# EAGLE design grblboard_base (EAGLE 7.5.0)
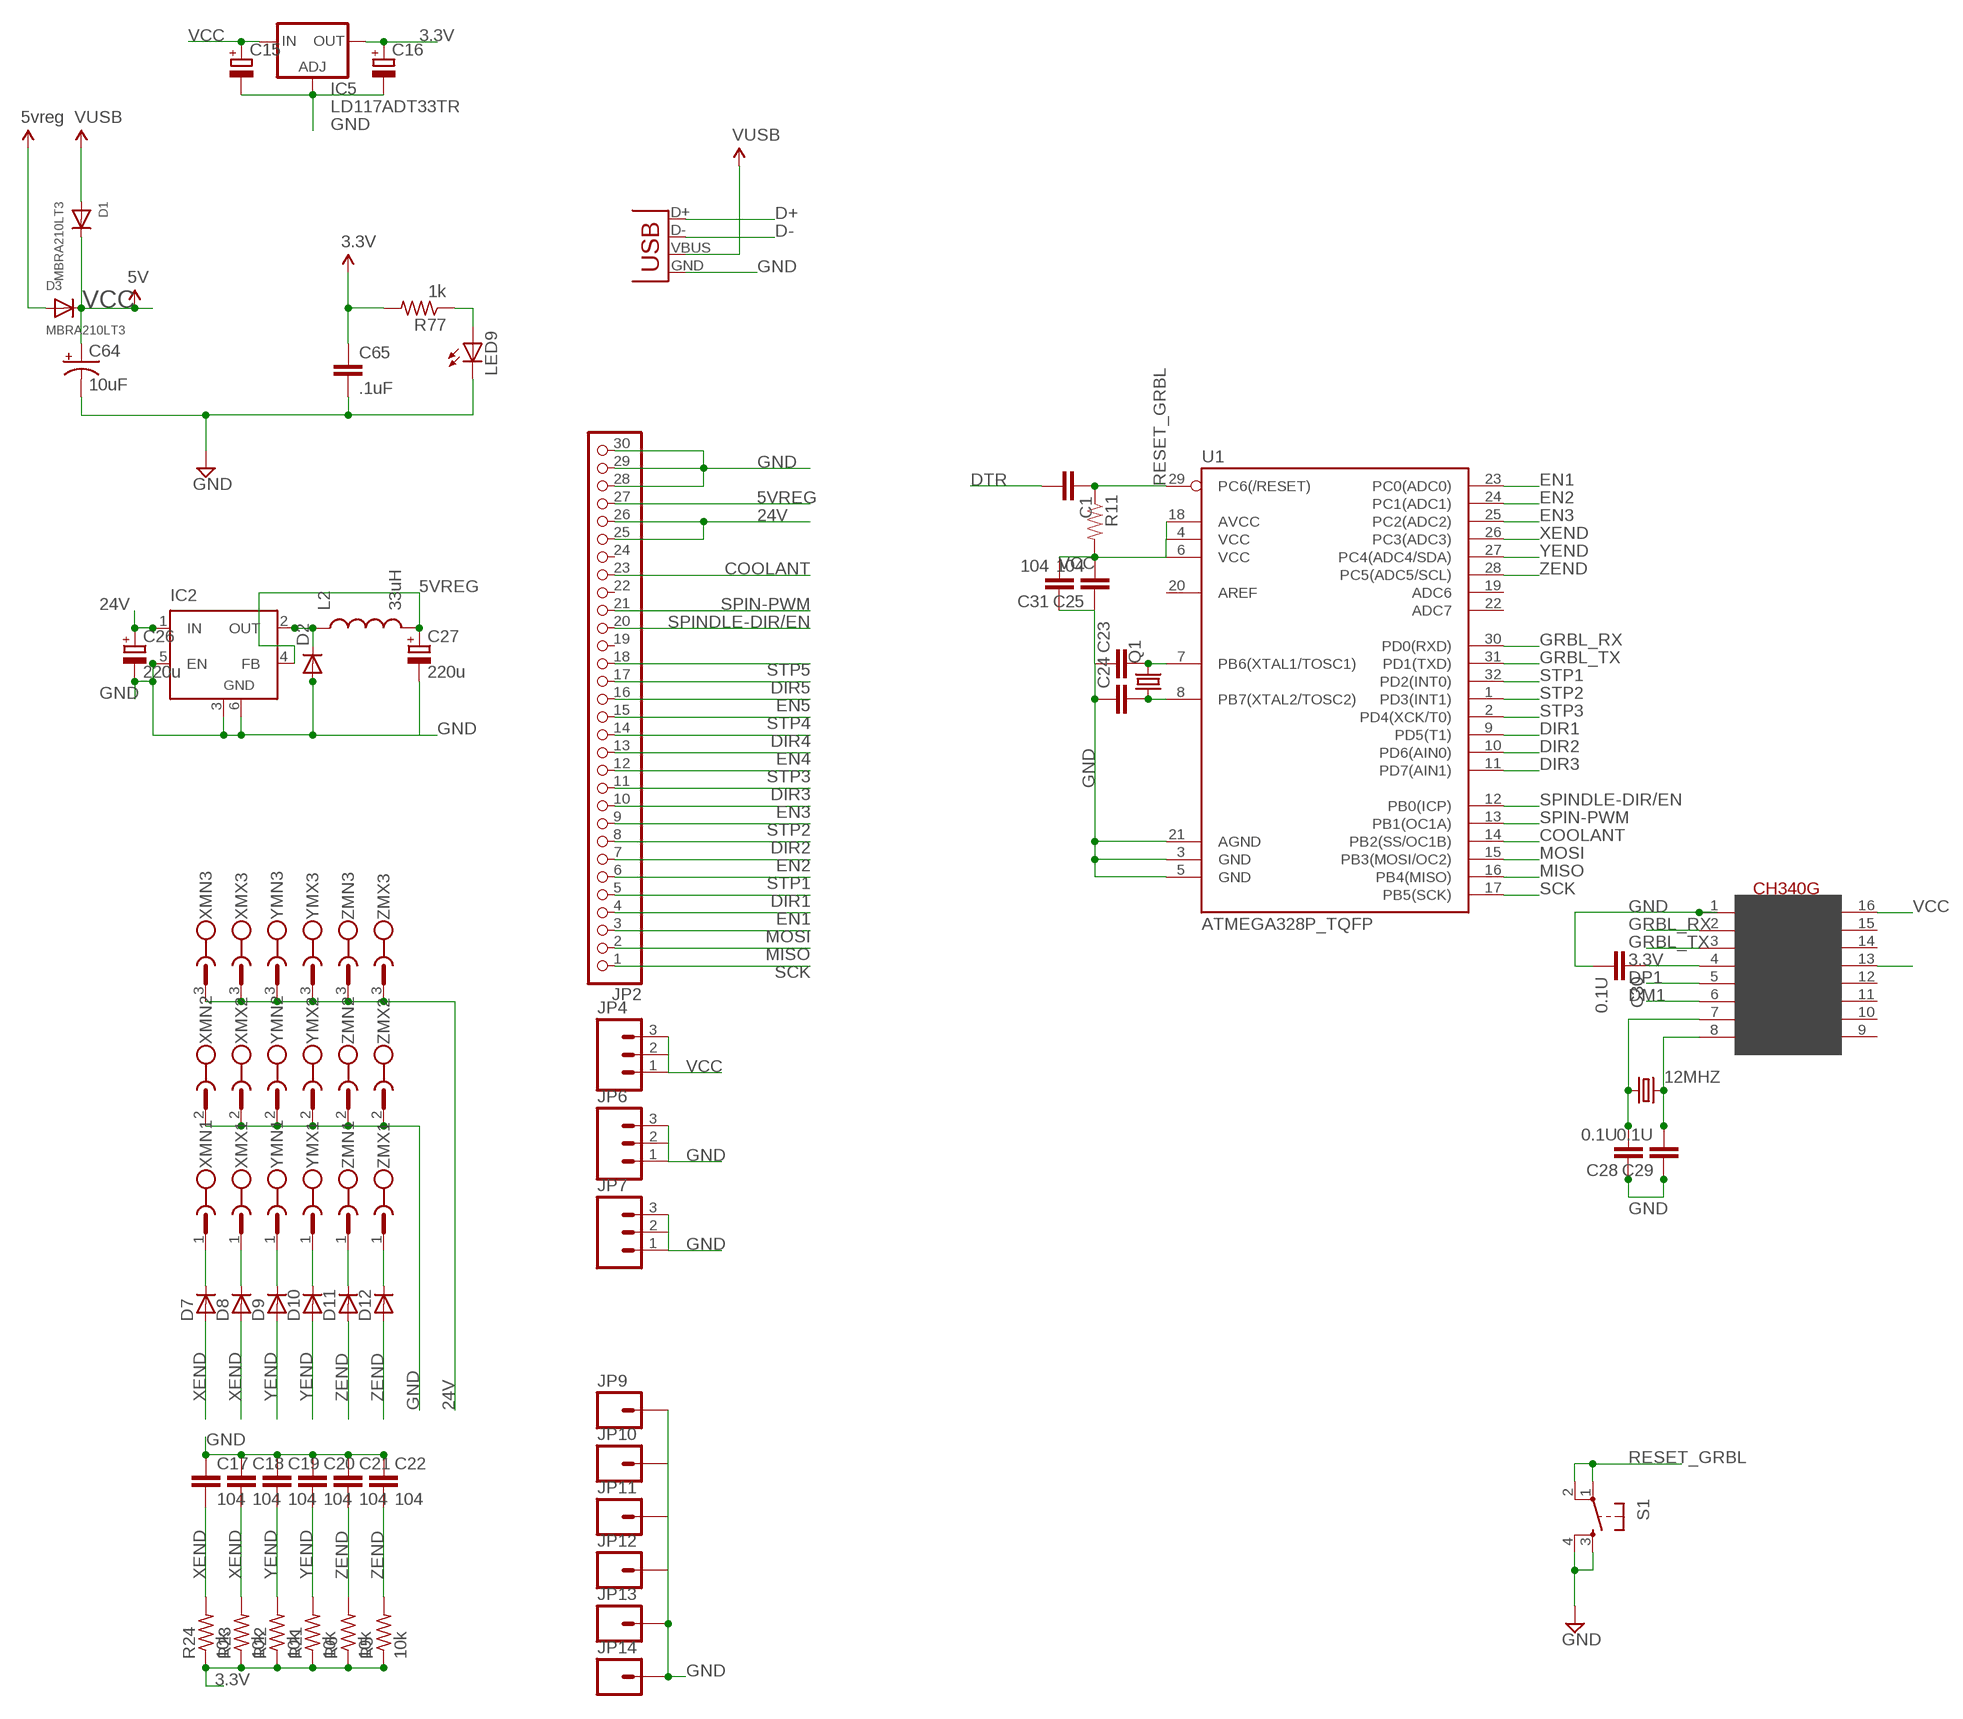
[diagram p0: schematic, sheet 1, part 1 of 2]
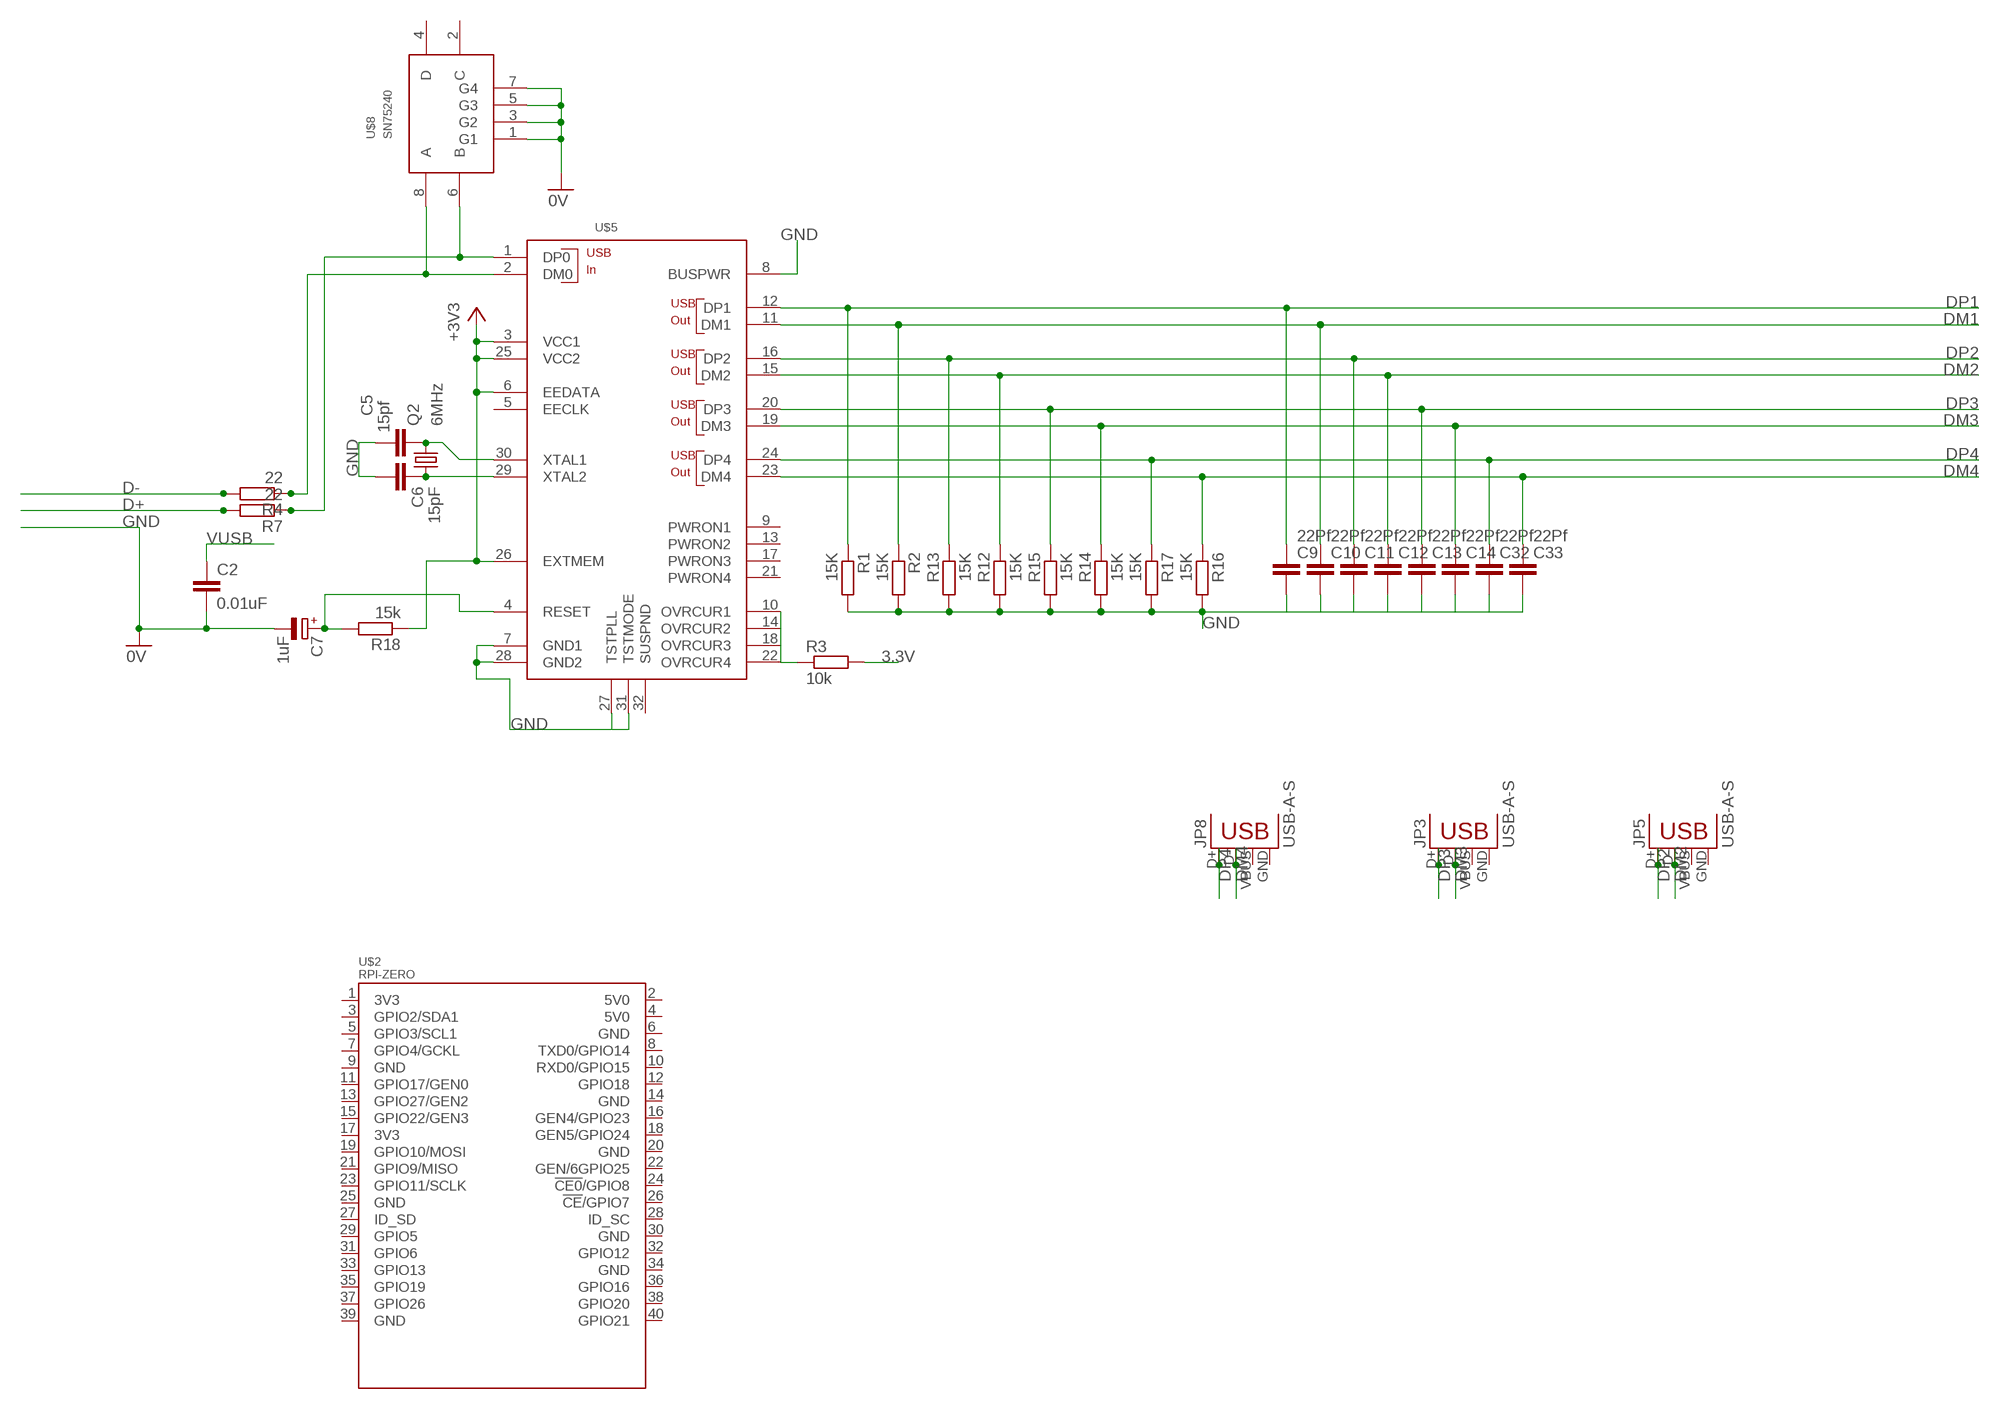
[diagram p1: schematic, sheet 1, part 2 of 2]

## Parts
12MHZ  CRYSTALHC49UP  [HC49UP]
C1  CAP1206  [1206]
C2  0.01uF  C-EUC0805  [C0805]
C5  15pf  C-EUC0805  [C0805]
C6  15pF  C-EUC0805  [C0805]
C7  1uF  CPOL-EUE2.5-6  [E2,5-6]
C9  22Pf  C-EUC0805  [C0805]
C10  22Pf  C-EUC0805  [C0805]
C11  22Pf  C-EUC0805  [C0805]
C12  22Pf  C-EUC0805  [C0805]
C13  22Pf  C-EUC0805  [C0805]
C14  22Pf  C-EUC0805  [C0805]
C15  CPOL-EUE2.5-7  [E2,5-7]
C16  CPOL-EUE2.5-7  [E2,5-7]
C17  104  C-EUC1206  [C1206]
C18  104  C-EUC1206  [C1206]
C19  104  C-EUC1206  [C1206]
C20  104  C-EUC1206  [C1206]
C21  104  C-EUC1206  [C1206]
C22  104  C-EUC1206  [C1206]
C23  CAP1206  [1206]
C24  CAP1206  [1206]
C25  104  CAP1206  [1206]
C26  220u  CPOL-EUE2.5-7  [E2,5-7]
C27  220u  CPOL-EUE2.5-7  [E2,5-7]
C28  0.1U  C-EUC1206  [C1206]
C29  0.1U  C-EUC1206  [C1206]
C30  0.1U  C-EUC1206  [C1206]
C31  104  CAP1206  [1206]
C32  22Pf  C-EUC0805  [C0805]
C33  22Pf  C-EUC0805  [C0805]
C64  10uF  CAP_POL1206  [EIA3216]
C65  .1uF  C-EUC0603  [C0603]
D1  MBRA210LT3  DIODESMA  [SMADIODE]
D2  DIODE-DO-214AC  [DO-214AC]
D3  MBRA210LT3  DIODESMA  [SMADIODE]
D7  D-SOD-87  [SOD87]
D8  D-SOD-87  [SOD87]
D9  D-SOD-87  [SOD87]
D10  D-SOD-87  [SOD87]
D11  D-SOD-87  [SOD87]
D12  D-SOD-87  [SOD87]
IC2  LM2596S  [TO263-5]
IC5  LD117ADT33TR  [DPACK]
JP2  PINHD-1X30  [1X30]
JP3  USB-A-S  [USB-A-S]
JP4  M03POGO_PIN_HOLES_ONLY  [1X03_PP_HOLES_ONLY]
JP5  USB-A-S  [USB-A-S]
JP6  M03POGO_PIN_HOLES_ONLY  [1X03_PP_HOLES_ONLY]
JP7  M03POGO_PIN_HOLES_ONLY  [1X03_PP_HOLES_ONLY]
JP8  USB-A-S  [USB-A-S]
JP9  M01NOSILK-KIT  [1X01NS-KIT]
JP10  M01NOSILK-KIT  [1X01NS-KIT]
JP11  M01NOSILK-KIT  [1X01NS-KIT]
JP12  M01NOSILK-KIT  [1X01NS-KIT]
JP13  M01NOSILK-KIT  [1X01NS-KIT]
JP14  M01NOSILK-KIT  [1X01NS-KIT]
L2  33uH  INDUCTORPWR  [CDRH125]
LED9  LEDCHIP-LED0805  [CHIP-LED0805]
Q1  CRYSTALHC49UP  [HC49UP]
Q2  6MHz  CRYSTALHC49UP  [HC49UP]
R1  15K  R-EU_R0805  [R0805]
R2  15K  R-EU_R0805  [R0805]
R3  10k  R-EU_R0805  [R0805]
R4  22  R-EU_R0805  [R0805]
R5  10k  R-US_M1206  [M1206]
R6  10k  R-US_M1206  [M1206]
R7  22  R-EU_R0805  [R0805]
R11  RESISTOR1206  [1206]
R12  15K  R-EU_R0805  [R0805]
R13  15K  R-EU_R0805  [R0805]
R14  15K  R-EU_R0805  [R0805]
R15  15K  R-EU_R0805  [R0805]
R16  15K  R-EU_R0805  [R0805]
R17  15K  R-EU_R0805  [R0805]
R18  15k  R-EU_R0805  [R0805]
R21  10k  R-US_M1206  [M1206]
R22  10k  R-US_M1206  [M1206]
R23  10k  R-US_M1206  [M1206]
R24  10k  R-US_M1206  [M1206]
R77  1k  R-US_R0603  [R0603]
S1  TAC_SWITCHSMD  [TACTILE_SWITCH_SMD]
U1  ATMEGA328P_TQFP  [TQFP32-08]
U$1  CH340G  [SOIC16]
U$2  RPI-ZERO  [RASPBERRYPI_BASTELSTUBE_V13_RASPI_BOARD_B+_FULL]
U$5  TUSB2046  [LQFP-32]
U$8  SN75240  [TSSOP8]
X14  USBPTH  [USB-B-PTH]
XMN  MC1.5/3  [MC1.5/3-G-3.81]
XMX  MC1.5/3  [MC1.5/3-G-3.81]
YMN  MC1.5/3  [MC1.5/3-G-3.81]
YMX  MC1.5/3  [MC1.5/3-G-3.81]
ZMN  MC1.5/3  [MC1.5/3-G-3.81]
ZMX  MC1.5/3  [MC1.5/3-G-3.81]

## Nets
3.3V: C16.+ C30.1 C65.1 IC5.4(OUT) R3.2 R5.1 R6.1 R18.1 R21.1 R22.1 R23.1 R24.1 R77.2 U$1.4(V3) U$5.3(VCC1) U$5.6(EEDATA) U$5.25(VCC2) U$5.26(EXTMEM) ; supply symbol labelled +3V3
5VREG: C27.+ D3.A IC2.4(FB) JP2.27 L2.2 ; supply symbol labelled 5vreg
24V: C26.+ IC2.1(IN) JP2.25 JP2.26 XMN.3 XMX.3 YMN.3 YMX.3 ZMN.3 ZMX.3
COOLANT: JP2.23 U1.14(PB2(SS/OC1B))
D+: R7.2 X14.D+
D-: R4.2 X14.D-
DIR1: JP2.5 U1.9(PD5(T1))
DIR2: JP2.8 U1.10(PD6(AIN0))
DIR3: JP2.11 U1.11(PD7(AIN1))
DIR4: JP2.14
DIR5: JP2.17
DM0: R4.1 U$5.2(DM0) U$8.8(A)
DM1: C10.1 R2.1 U$1.6(D-) U$5.11(DM1)
DM2: C12.1 JP5.D- R12.1 U$5.15(DM2)
DM3: C14.1 JP3.D- R14.1 U$5.19(DM3)
DM4: C33.1 JP8.D- R16.1 U$5.23(DM4)
DP0: R7.1 U$5.1(DP0) U$8.6(B)
DP1: C9.1 R1.1 U$1.5(D+) U$5.12(DP1)
DP2: C11.1 JP5.D+ R13.1 U$5.16(DP2)
DP3: C13.1 JP3.D+ R15.1 U$5.20(DP3)
DP4: C32.1 JP8.D+ R17.1 U$5.24(DP4)
DTR: C1.2 U$1.13(DTR)
EN1: JP2.4 U1.23(PC0(ADC0))
EN2: JP2.7 U1.24(PC1(ADC1))
EN3: JP2.10 U1.25(PC2(ADC2))
EN4: JP2.13
EN5: JP2.16
GND: C2.2 C5.1 C6.2 C7.- C9.2 C10.2 C11.2 C12.2 C13.2 C14.2 C15.- C16.- C17.1 C18.1 C19.1 C20.1 C21.1 C22.1 C23.1 C24.1 C25.1 C26.- C27.- C28.1 C29.1 C30.2 C31.1 C32.2 C33.2 C64.C(-) C65.2 D2.2(A) IC2.3(GND) IC2.5(EN) IC2.6(GND) IC5.1(ADJ) JP2.28 JP2.29 JP2.30 JP6.1 JP6.2 JP6.3 JP7.1 JP7.2 JP7.3 JP9.1 JP10.1 JP11.1 JP12.1 JP13.1 JP14.1 LED9.C R1.2 R2.2 R12.2 R13.2 R14.2 R15.2 R16.2 R17.2 S1.3 S1.4 U1.3(GND) U1.5(GND) U1.21(AGND) U$1.1(GND) U$5.7(GND1) U$5.8(BUSPWR) U$5.27(TSTPLL) U$5.28(GND2) U$5.31(TSTMODE) U$8.1(G1) U$8.3(G2) U$8.5(G3) U$8.7(G4) X14.GND XMN.2 XMX.2 YMN.2 YMX.2 ZMN.2 ZMX.2 ; supply symbol labelled 0V
GRBL_RX: U1.30(PD0(RXD)) U$1.2(TX)
GRBL_TX: U1.31(PD1(TXD)) U$1.3(RX)
MISO: JP2.2 U1.16(PB4(MISO))
MOSI: JP2.3 U1.15(PB3(MOSI/OC2))
N$3: R3.1 U$5.10(OVRCUR1) U$5.14(OVRCUR2) U$5.18(OVRCUR3) U$5.22(OVRCUR4)
N$4: 12MHZ.1 C28.2 U$1.7(XI)
N$6: D7.1(C) XMN.1
N$8: D8.1(C) XMX.1
N$9: D2.1(C) IC2.2(OUT) L2.1
N$10: D9.1(C) YMN.1
N$12: D10.1(C) YMX.1
N$13: C23.2 Q1.2 U1.7(PB6(XTAL1/TOSC1))
N$14: C24.2 Q1.1 U1.8(PB7(XTAL2/TOSC2))
N$15: D11.1(C) ZMN.1
N$16: D12.1(C) ZMX.1
N$19: 12MHZ.2 C29.2 U$1.8(XO)
N$80: LED9.A R77.1
RESET: C7.+ R18.2 U$5.4(RESET)
RESET_GRBL: C1.1 R11.1 S1.1 S1.2 U1.29(PC6(/RESET))
SCK: JP2.1 U1.17(PB5(SCK))
SPIN-PWM: JP2.21 U1.13(PB1(OC1A))
SPINDLE-DIR/EN: JP2.20 U1.12(PB0(ICP))
STP1: JP2.6 U1.32(PD2(INT0))
STP2: JP2.9 U1.1(PD3(INT1))
STP3: JP2.12 U1.2(PD4(XCK/T0))
STP4: JP2.15
STP5: JP2.18
VCC: C15.+ C25.2 C31.2 C64.A(+) D1.C D3.C IC5.3(IN) JP4.1 JP4.2 JP4.3 R11.2 U1.4(VCC) U1.6(VCC) U1.18(AVCC) U$1.16(VCC) ; supply symbol labelled 5V
VUSB: C2.1 D1.A X14.VBUS
XEND: C17.2 C18.2 D7.2(A) D8.2(A) R23.2 R24.2 U1.26(PC3(ADC3))
XTAL1: C5.2 Q2.2 U$5.30(XTAL1)
XTAL2: C6.1 Q2.1 U$5.29(XTAL2)
YEND: C19.2 C20.2 D9.2(A) D10.2(A) R21.2 R22.2 U1.27(PC4(ADC4/SDA))
ZEND: C21.2 C22.2 D11.2(A) D12.2(A) R5.2 R6.2 U1.28(PC5(ADC5/SCL))
Unconnected: JP2.19 JP2.22 JP2.24 JP3.GND JP3.VBUS JP5.GND JP5.VBUS JP8.GND JP8.VBUS U1.19(ADC6) U1.20(AREF) U1.22(ADC7) U$1.9(CTS) U$1.10(DSR) U$1.11(RI) U$1.12(DCD) U$1.14(RTS) U$1.15(RS232) U$2.1(3V3) U$2.2(5V0) U$2.3(GPIO2/SDA1) U$2.4(5V0) U$2.5(GPIO3/SCL1) U$2.6(GND) U$2.7(GPIO4/GCKL) U$2.8(TXD0/GPIO14) U$2.9(GND) U$2.10(RXD0/GPIO15) U$2.11(GPIO17/GEN0) U$2.12(GPIO18) U$2.13(GPIO27/GEN2) U$2.14(GND) U$2.15(GPIO22/GEN3) U$2.16(GEN4/GPIO23) U$2.17(3V3) U$2.18(GEN5/GPIO24) U$2.19(GPIO10/MOSI) U$2.20(GND) U$2.21(GPIO9/MISO) U$2.22(GEN/6GPIO25) U$2.23(GPIO11/SCLK) U$2.24(!CE0!/GPIO8) U$2.25(GND) U$2.26(!CE!/GPIO7) U$2.27(ID_SD) U$2.28(ID_SC) U$2.29(GPIO5) U$2.30(GND) U$2.31(GPIO6) U$2.32(GPIO12) U$2.33(GPIO13) U$2.34(GND) U$2.35(GPIO19) U$2.36(GPIO16) U$2.37(GPIO26) U$2.38(GPIO20) U$2.39(GND) U$2.40(GPIO21) U$5.5(EECLK) U$5.9(PWRON1) U$5.13(PWRON2) U$5.17(PWRON3) U$5.21(PWRON4) U$5.32(SUSPND) U$8.2(C) U$8.4(D)

## Library data of the parts
12MHZ = crystal:CRYSTAL: CRYSTAL; OC_FARNELL: unknown; OC_NEWARK: unknown
C1 C23-C25 C31 = SparkFun-Capacitors:CAP: Capacitor Standard 0603 ceramic capacitor, and 0.1" leaded capacitor.
C2 C5 C6 C9-C14 C17-C22 C28-C30 C32 C33 = rcl:C-EU: CAPACITOR, European symbol
C7 C15 C16 C26 C27 = rcl:CPOL-EU: POLARIZED CAPACITOR, European symbol
C64 = SparkFun:CAP_POL: Capacitor Polarized These are standard SMD and PTH capacitors. Normally 10uF, 47uF, and 100uF in electrolytic and tantalum varieties. Always verify the external diameter of the through hole cap, it varies with capacity, voltage, and manufacturer. The EIA devices should be standard.
C65 = resistor:C-EU: CAPACITOR, European symbol
D1 D3 = microbuilder:DIODE: Diode SMADIODE - SMA Surface Mount Package 20V 1A Schottky Diode Digikey (500mV @ 1A, 500uA Vr @ 20V): 641-1014-6-ND 10V 2A Schottky Diode Digikey (350mV @ 2A, 700uA Vr @ 10V): MBRA210LT3 SOD-123 30V 200mA (800mV Vf, 2uA Vr @ 25V) Schottky Diode (very fast switching for boost, etc.) - Digikey: BAT54T1GOSTR-ND 30V 500mA (430mV Vf, 130uA Vr @ 30V) Schottky Diode - Digikey: B0530W-FDICT-ND MBR120 1A 20V (0.34Vf) Schottky Diode - Digikey: MBR120VLSFT1GOSCT-ND SOD-323 10V 570mA (380mV Vf, 3ns) Schottky Diode - Digikey: ZLLS410CT-ND 1N4148WS - 75V 150mA (1V Vf @ 10mA, 4ns) Simple Diode - Digikey: 1N4148WSFSCT-ND, Mouser: 512-1N4148WS SOD-523 BAT54 30V 200mA Schottky (0.8 Vf @ 100mA, 5ns) - Digikey: BAT54XV2CT-ND 30V 30mA Schottky Diode (RB751S-40TE61) - Digikey: RB751S-40TE61CT-ND SOT23-R/W - SOT23 Package (R = Solder Paste/Reflow Ovens, W = Hand-Soldering) BAT54Film 40V 300mA - Digikey: 497-7162-1-ND DO-1N4148 Through Hole Small Current Diode (any model)
D2 = dp_devices:DIODE: Various Diode Packages
D7-D12 = semicon-smd-ipc:D-: DIODE unfilled
IC2 = linear:LM2596S: STEP-DOWN VOLTAGE REGULATOR
IC5 = v-reg:LD117A?*: Low drop fixed and adjustable positive voltage regulators 1 A Source: http://www.st.com/stonline/products/literature/ds/7194/ld1117axx.pdf
JP2 = pinhead:PINHD-1X30: PIN HEADER
JP3 JP5 JP8 = SparkFun-Connectors:USB: USB Connectors USB-B-PTH is fully proven SKU : PRT-00139/CONN-08278 USB-miniB is fully proven SKU : PRT-00587 USB-A-PCB is untested. USB-A-H is throughly reviewed, but untested. Spark Fun Electronics SKU : PRT-00437 USB-B-SMT is throughly reviewed, but untested. Needs silkscreen touching up. USB-A-S has not been used/tested USB-MB-H has not been used/tested USB-MICROB has been used. CONN-09505
JP4 JP6 JP7 = SparkFun-Connectors:M03: Header 3 Standard 3-pin 0.1" header. Use with straight break away headers (SKU : PRT-00116), right angle break away headers (PRT-00553), swiss pins (PRT-00743), machine pins (PRT-00117), and female headers (PRT-00115). Molex polarized connector foot print use with SKU : PRT-08232 with associated crimp pins and housings.
JP9-JP14 = SparkFun-Connectors:M01: Header 1 Standard 1-pin 0.1" header. Use with straight break away headers (SKU : PRT-00116), right angle break away headers (PRT-00553), swiss pins (PRT-00743), machine pins (PRT-00117), and female headers (PRT-00115). SMTSO-256-ET is a "flush mount" nut for a 4-40 screw. The older package used to be too tight, and did not allow it to sit properly thru the drill hit. The latest (0.165DIA) fits nice and snug.
L2 = SparkFun-Passives:INDUCTOR: Inductors Basic Inductor/Choke - 0603 and 1206. Footprints are not proven and vary greatly between part numbers. INDUCTOR POWER 3.3UH 4.0A SMD 0.197" L x 0.197" W x 0.177" H (5.00mm x 5.00mm x 4.50mm)
LED9 = led:LED: LED OSRAM: - CHIPLED LG R971, LG N971, LY N971, LG Q971, LY Q971, LO R971, LY R971 LH N974, LH R974 LS Q976, LO Q976, LY Q976 LO Q996 - Hyper CHIPLED LW Q18S LB Q993, LB Q99A, LB R99A - SideLED LS A670, LO A670, LY A670, LG A670, LP A670 LB A673, LV A673, LT A673, LW A673 LH A674 LY A675 LS A676, LA A676, LO A676, LY A676, LW A676 LS A679, LY A679, LG A679 - Hyper Micro SIDELED® LS Y876, LA Y876, LO Y876, LY Y876 LT Y87S - SmartLED LW L88C, LW L88S LB L89C, LB L89S, LG L890 LS L89K, LO L89K, LY L89K LS L896, LA L896, LO L896, LY L896 - TOPLED LS T670, LO T670, LY T670, LG T670, LP T670 LSG T670, LSP T670, LSY T670, LOP T670, LYG T670 LG T671, LOG T671, LSG T671 LB T673, LV T673, LT T673, LW T673 LH T674 LS T676, LA T676, LO T676, LY T676, LB T676, LH T676, LSB T676, LW T676 LB T67C, LV T67C, LT T67C, LS T67K, LO T67K, LY T67K, LW E67C LS E67B, LA E67B, LO E67B, LY E67B, LB E67C, LV E67C, LT E67C LW T67C LS T679, LY T679, LG T679 LS T770, LO T770, LY T770, LG T770, LP T770 LB T773, LV T773, LT T773, LW T773 LH T774 LS E675, LA E675, LY E675, LS T675 LS T776, LA T776, LO T776, LY T776, LB T776 LHGB T686 LT T68C, LB T68C - Hyper Mini TOPLED® LB M676 - Mini TOPLED Santana® LG M470 LS M47K, LO M47K, LY M47K Source: http://www.osram.convergy.de LUXEON: - LUMILED® LXK2-PW12-R00, LXK2-PW12-S00, LXK2-PW14-U00, LXK2-PW14-V00 LXK2-PM12-R00, LXK2-PM12-S00, LXK2-PM14-U00 LXK2-PE12-Q00, LXK2-PE12-R00, LXK2-PE12-S00, LXK2-PE14-T00, LXK2-PE14-U00 LXK2-PB12-K00, LXK2-PB12-L00, LXK2-PB12-M00, LXK2-PB14-N00, LXK2-PB14-P00, LXK2-PB14-Q00 LXK2-PR12-L00, LXK2-PR12-M00, LXK2-PR14-Q00, LXK2-PR14-R00 LXK2-PD12-Q00, LXK2-PD12-R00, LXK2-PD12-S00 LXK2-PH12-R00, LXK2-PH12-S00 LXK2-PL12-P00, LXK2-PL12-Q00, LXK2-PL12-R00 Source: www.luxeon.com KINGBRIGHT: KA-3528ASYC Source: www.kingbright.com
Q1 = adafruit:CRYSTAL: CRYSTAL; OC_FARNELL: unknown; OC_NEWARK: unknown
Q2 = new_mcp:CRYSTAL: CRYSTAL
R1-R4 R7 R12-R18 = rcl:R-EU_: RESISTOR, European symbol
R5 R6 R21-R24 = adafruit:R-US_: RESISTOR, American symbol
R11 = SparkFun-Passives:RESISTOR: Resistor Basic schematic elements and footprints for 0603, 1206, and PTH resistors.
R77 = resistor:R-US_: RESISTOR, American symbol
S1 = SparkFun:TAC_SWITCH: Momentary Switch Button commonly used for reset or general input. Spark Fun Electronics SKU : COM-00097
U1 = SparkFun-DigitalIC:ATMEGA328P_TQFP; PROD_ID: IC-09069
U$1 = usb-serial:CH340G
U$2 = RPI-Zero:RPI-ZERO
U$5 = usb-conc:TUSB2046; ORDERCODE: 1470507; SUPPLIER: farnell
U$8 = usb-conc:SN75240; ORDERCODE: 1207275; SUPPLIER: farnell
X14 = SparkFun:USB: USB Connectors USB-B-PTH is fully proven SKU : PRT-00139 USB-miniB is fully proven SKU : PRT-00587 USB-A-PCB is untested. USB-A-H is throughly reviewed, but untested. Spark Fun Electronics SKU : PRT-00437 USB-B-SMT is throughly reviewed, but untested. Needs silkscreen touching up. USB-A-S has not been used/tested USB-MB-H has not been used/tested
XMN XMX YMN YMX ZMN ZMX = jt-con-phoenix-3.81:MC1.5/3: PHOENIX

## Net classes
1 power: width 0.6 mm, clearance 0.305 mm

## Board
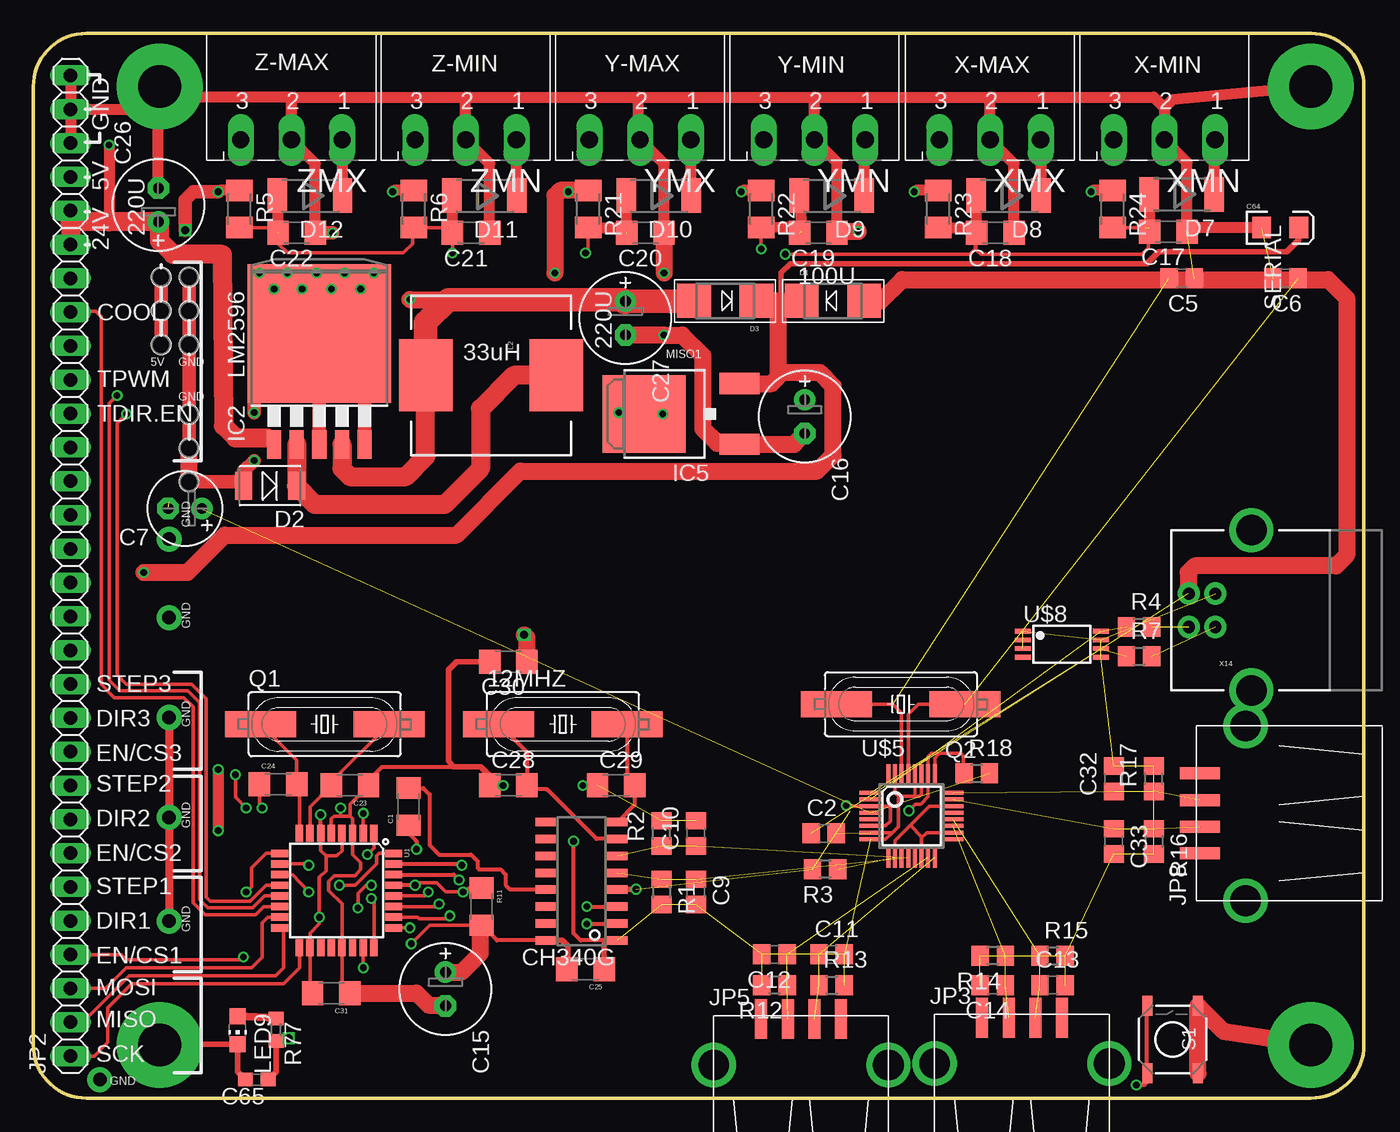
[diagram p2: board, top side]
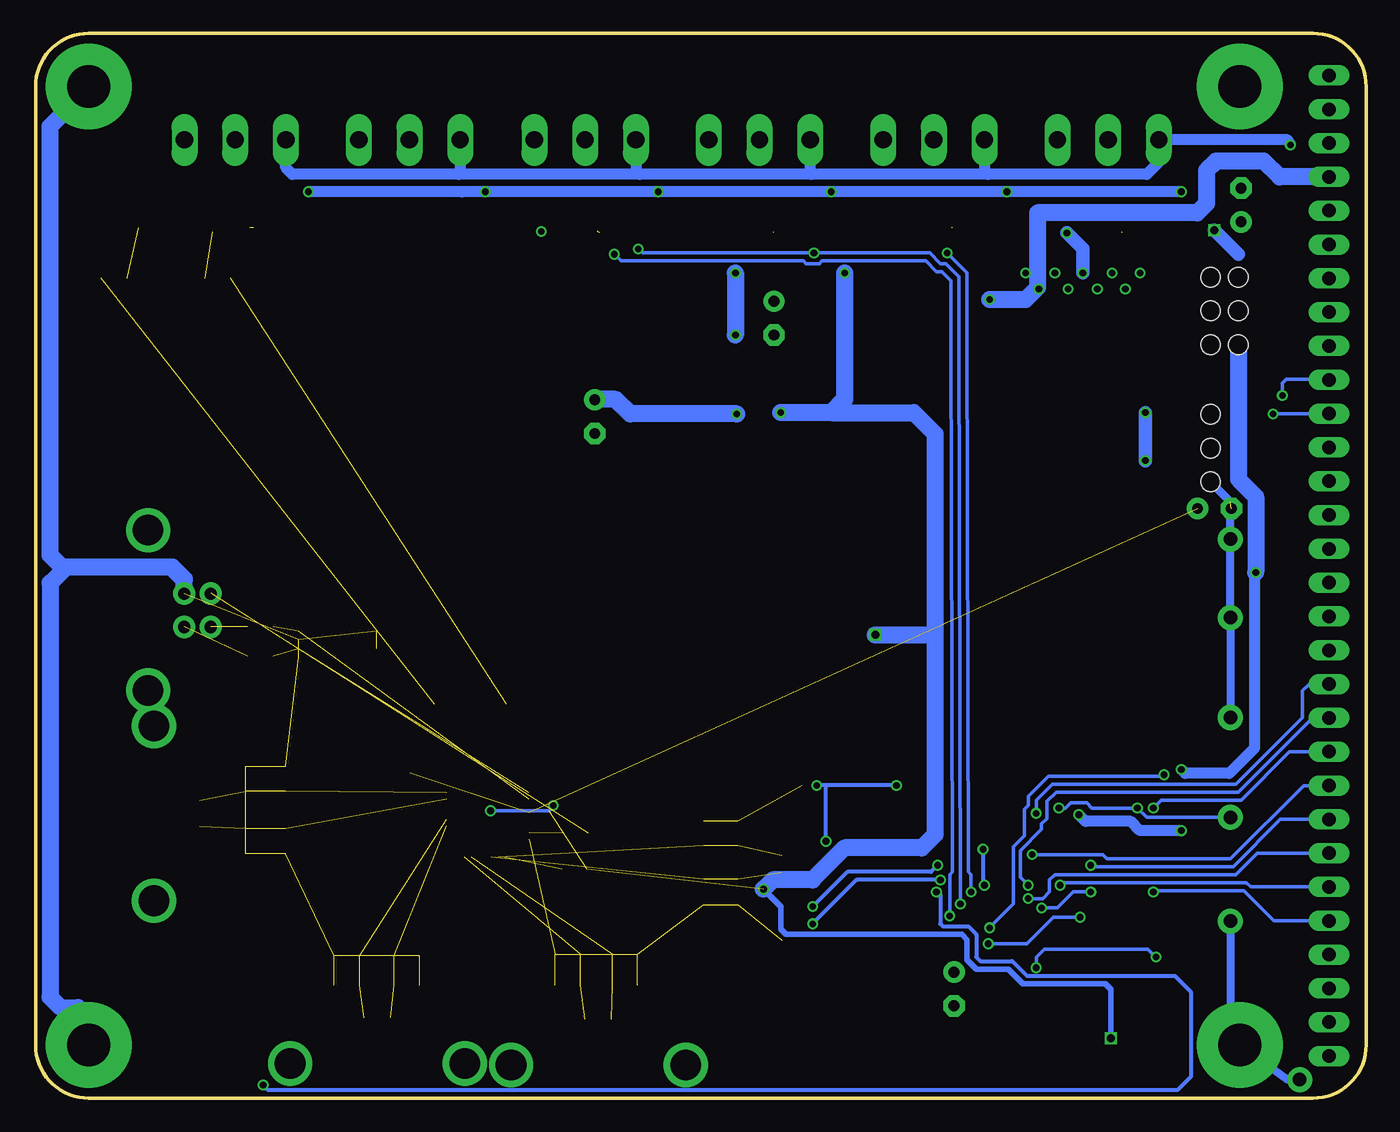
[diagram p3: board, bottom side, seen from below]

Size 100 x 80 mm. Coordinates in mm from the lower left corner, seen from the top.
Outline: 4,0 96,0 arc90 100,4 100,76 arc90 96,80 4,80 arc90 0,76 0,4 arc90 4,0
Copper layers (1*16): Top 0.035mm / dielectric 1.5mm / Bottom 0.035mm
Design rules "dirt_cheap_dirty_boards.v1": minimum track width 5mil, minimum drill 12mil, track to track 5mil, track to pad 5mil, pad to pad 5mil, via to via 5mil, smd to smd 0mil, copper to edge 10mil, drill to drill 10mil, minimum pad ring 10mil, minimum via ring 6mil, stop-mask expansion 2mil, vias tented up to drill 25mil, thermal gap 10mil
Holes 2 mm at 6.8,-36.5 17.7,-36.5 17.7,-32 6.7,-32

### Footprints (pad centres in the part's own frame; a part is rotated, then mirrored left to right if it is on the bottom)
HC49UP = smd 5.334 x 1.93: 1 -4.826,0; 2 4.826,0
1206 = smd 1.6 x 1.8: 1 -1.4,0; 2 1.4,0
C0805 = smd 1.3 x 1.5: 1 -0.95,0; 2 0.95,0
E2,5-6 = drill 0.813 pad 1.6: + -1.27,0 | drill 0.813 pad 1.6 octagon: - 1.27,0
E2,5-7 = drill 0.813 pad 1.6: + -1.27,0 | drill 0.813 pad 1.6 octagon: - 1.27,0
C1206 = smd 1.6 x 1.8: 1 -1.4,0; 2 1.4,0
EIA3216 = smd 1.4 x 1.6: A 1.4,0; C -1.4,0
C0603 = smd 1.1 x 1: 1 -0.85,0; 2 0.85,0
SMADIODE = smd 2.54 x 2.54: A 2.349,0; C -2.349,0
DO-214AC = smd 1.27 x 2.1: 1 -1.98,0; 2 1.98,0
SOD87 = smd 1.45 x 2.6: 1 -2.445,0; 2 2.445,0
TO263-5 = smd 1.067 x 2.159: 1 -3.404,-5.791; 2 -1.702,-5.791; 3 0,-5.791; 4 1.702,-5.791; 5 3.404,-5.791 | smd 10.8 x 10.41: 6 0,2.54
DPACK = smd 1.6 x 3: 1 -2.28,-4.8; 3 2.28,-4.8 | smd 5.8 x 6.2: 4 0,2.38
1X30 = drill 1.016 long: 1 -36.83,0; 2 -34.29,0; 3 -31.75,0; 4 -29.21,0; 5 -26.67,0; 6 -24.13,0; 7 -21.59,0; 8 -19.05,0; 9 -16.51,0; 10 -13.97,0; 11 -11.43,0; 12 -8.89,0; 13 -6.35,0; 14 -3.81,0; 15 -1.27,0; 16 1.27,0; 17 3.81,0; 18 6.35,0; 19 8.89,0; 20 11.43,0; 21 13.97,0; 22 16.51,0; 23 19.05,0; 24 21.59,0; 25 24.13,0; 26 26.67,0; 27 29.21,0; 28 31.75,0; 29 34.29,0; 30 36.83,0
USB-A-S = smd 3 x 0.9: D+ 3.45,-1; D- 3.45,1; GND 3.45,-3; VBUS 3.45,3 | drill 2.311: P$5 0,-6.566; P$6 0,6.566
1X03_PP_HOLES_ONLY = drill 0.9 pad 0.813: 1 0,0; 2 2.54,0; 3 5.08,0 | hole 1.473: 0,0; 2.54,0; 5.08,0
1X01NS-KIT = drill 1.016 pad 1.88: 1 0,0
CDRH125 = smd 5.4 x 4: 1 0,4.9; 2 0,-4.9
CHIP-LED0805 = smd 1.2 x 1.2: A 0,-1.05; C 0,1.05
R0805 = smd 1.3 x 1.5: 1 -0.95,0; 2 0.95,0
M1206 = smd 1.6 x 2: 1 -1.4,0; 2 1.4,0
R0603 = smd 1 x 1.1: 1 -0.85,0; 2 0.85,0
TACTILE_SWITCH_SMD = smd 1.524 x 0.762: 1 -2.54,1.905; 2 2.54,1.905; 3 -2.54,-1.905; 4 2.54,-1.905
TQFP32-08 = smd 1.27 x 0.559: 1 -4.293,2.8; 2 -4.293,2; 3 -4.293,1.2; 4 -4.293,0.4; 5 -4.293,-0.4; 6 -4.293,-1.2; 7 -4.293,-2; 8 -4.293,-2.8; 17 4.293,-2.8; 18 4.293,-2; 19 4.293,-1.2; 20 4.293,-0.4; 21 4.293,0.4; 22 4.293,1.2; 23 4.293,2; 24 4.293,2.8 | smd 0.559 x 1.27: 9 -2.8,-4.293; 10 -2,-4.293; 11 -1.2,-4.293; 12 -0.4,-4.293; 13 0.4,-4.293; 14 1.2,-4.293; 15 2,-4.293; 16 2.8,-4.293; 25 2.8,4.293; 26 2,4.293; 27 1.2,4.293; 28 0.4,4.293; 29 -0.4,4.293; 30 -1.2,4.293; 31 -2,4.293; 32 -2.8,4.293
SOIC16 = smd 0.635 x 1.524: 1 -4.445,-2.695; 2 -3.175,-2.695; 3 -1.905,-2.695; 4 -0.635,-2.695; 5 0.635,-2.695; 6 1.905,-2.695; 7 3.175,-2.695; 8 4.445,-2.695; 9 4.445,2.695; 10 3.175,2.695; 11 1.905,2.695; 12 0.635,2.695; 13 -0.635,2.695; 14 -1.905,2.695; 15 -3.175,2.695; 16 -4.445,2.695
RASPBERRYPI_BASTELSTUBE_V13_RASPI_BOARD_B+_FULL = drill 1 pad 1.778 square: 1 8.37,25.23 | drill 1 pad 1.778: 2 8.37,27.77; 3 10.91,25.23; 4 10.91,27.77; 5 13.45,25.23; 6 13.45,27.77; 7 15.99,25.23; 8 15.99,27.77; 9 18.53,25.23; 10 18.53,27.77; 11 21.07,25.23; 12 21.07,27.77; 13 23.61,25.23; 14 23.61,27.77; 15 26.15,25.23; 16 26.15,27.77; 17 28.69,25.23; 18 28.69,27.77; 19 31.23,25.23; 20 31.23,27.77; 21 33.77,25.23; 22 33.77,27.77; 23 36.31,25.23; 24 36.31,27.77; 25 38.85,25.23; 26 38.85,27.77; 27 41.39,25.23; 28 41.39,27.77; 29 43.93,25.23; 30 43.93,27.77; 31 46.47,25.23; 32 46.47,27.77; 33 49.01,25.23; 34 49.01,27.77; 35 51.55,25.23; 36 51.55,27.77; 37 54.09,25.23; 38 54.09,27.77; 39 56.63,25.23; 40 56.63,27.77
LQFP-32 = smd 0.3 x 1.6: 1 -1.75,-3.1; 2 -1.25,-3.1; 3 -0.75,-3.1; 4 -0.25,-3.1; 5 0.25,-3.1; 6 0.75,-3.1; 7 1.25,-3.1; 8 1.75,-3.1; 17 1.75,3.1; 18 1.25,3.1; 19 0.75,3.1; 20 0.25,3.1; 21 -0.25,3.1; 22 -0.75,3.1; 23 -1.25,3.1; 24 -1.75,3.1 | smd 1.6 x 0.3: 9 3.1,-1.75; 10 3.1,-1.25; 11 3.1,-0.75; 12 3.1,-0.25; 13 3.1,0.25; 14 3.1,0.75; 15 3.1,1.25; 16 3.1,1.75; 25 -3.1,1.75; 26 -3.1,1.25; 27 -3.1,0.75; 28 -3.1,0.25; 29 -3.1,-0.25; 30 -3.1,-0.75; 31 -3.1,-1.25; 32 -3.1,-1.75
TSSOP8 = smd 1.2 x 0.35: 1 -2.925,0.975; 2 -2.925,0.325; 3 -2.925,-0.325; 4 -2.925,-0.975; 5 2.925,-0.975; 6 2.925,-0.325; 7 2.925,0.325; 8 2.925,0.975
USB-B-PTH = drill 0.914 pad 1.676: D+ 0,1.25; D- 1.981,1.25; GND 0,-1.25; VBUS 1.981,-1.25 | drill 2.286: S1 -2.718,-6.02; S2 -2.718,6.02
MC1.5/3-G-3.81 = drill 1.3 long: 1 -3.81,8; 2 0,8; 3 3.81,8

### Placement (x,y rotation side)
12MHZ  39.8,28.1 0 top
C1  28.2,21.9 90 top
C2  59.4,19.9 0 top
C5  86.3,61.6 180 top
C6  94.1,61.6 180 top
C7  11.4,44.3 180 top
C9  49.8,15.5 270 top
C10  49.8,19.9 90 top
C11  60,10.8 0 top
C12  55.7,10.8 180 top
C13  76.6,8.5 0 top
C14  72.1,8.5 180 top
C15  30.98,8.21 270 top
C16  57.98,51.2 270 top
C17  85.3,65.1 180 top
C18  72.3,65 180 top
C19  59,65 180 top
C20  46,65 180 top
C21  32.9,65 180 top
C22  19.8,65 180 top
C23  23.8,23.5 180 top
C24  18.4,23.6 0 top
C25  41.5,9.7 180 top
C26  9.4,67.1 90 top
C27  44.5,58.6 270 top
C28  35.7,23.5 0 top
C29  43.8,23.5 0 top
C30  35.7,32.8 180 top
C31  22.4,7.9 180 top
C32  81.2,24 90 top
C33  81.2,19.3 270 top
C64  93.7,65.4 0 top
C65  16.8,1.4 180 top
D1  60.1,59.9 0 top
D2  17.8,46 180 top
D3  52,59.9 180 top
D7  86.3,67.9 180 top
D8  73.3,67.8 180 top
D9  60,67.8 180 top
D10  47,67.8 180 top
D11  33.9,67.8 180 top
D12  20.8,67.8 180 top
IC2  21.5,54.9 0 top
IC5  48.28,51.41 90 top
JP2  2.8,40 90 top
JP3  74.3,2.6 90 top
JP4  9.6,56.6 90 top
JP5  57.7,2.5 90 top
JP6  11.7,56.6 90 top
JP7  11.7,46.3 90 top
JP8  91.1,21.4 180 top
JP9  10.2,36.1 0 top
JP10  10.2,13.3 0 top
JP11  10.2,21.1 0 top
JP12  10.2,28.6 0 top
JP13  5,1.4 0 top
JP14  10.2,42 0 top
L2  34.4,54.3 270 top
LED9  15.35,5.1 180 top
Q1  21.9,28.1 0 top
Q2  65.2,29.6 180 top
R1  47.2,15.5 270 top
R2  47.2,19.9 90 top
R3  59.5,17.2 180 top
R4  83.1,35.4 0 top
R5  15.5,66.8 270 top
R6  28.6,66.8 270 top
R7  83.1,33.2 0 top
R11  33.7,14.4 270 top
R12  55.7,8.5 180 top
R13  60,8.5 0 top
R14  72.1,10.7 180 top
R15  76.6,10.7 0 top
R16  84.2,19.3 270 top
R17  84.2,24 90 top
R18  70.9,24.4 0 top
R21  41.7,66.8 270 top
R22  54.7,66.8 270 top
R23  68,66.8 270 top
R24  81.1,66.8 270 top
R77  18.25,5.15 270 top
S1  85.62,4.41 90 top
U1  22.8,15.6 270 top
U$1  41.2,16.3 90 top
U$2  -0.5,-38 0 top  (outside the outline)
U$5  66,21.2 270 top
U$8  77.3,34.1 0 top
X14  88.82,36.66 180 top
XMN  85,80 180 top
XMX  71.9,80 180 top
YMN  58.7,80 180 top
YMX  45.6,80 180 top
ZMN  32.5,80 180 top
ZMX  19.4,80 180 top

### Tracks (layer width: path | path; a pad name or v marks a point on that pad's centre or on a via)
3.3V  (via drill 0.5, 0.5 pad 0.25, 0.6)  (2 unrouted)
  Top 0.254: U$5.25 67.75,25.55 68.1,25.9 | 68.1,25.9 69.7,25.9 69.9,25.7 69.9,24.45 R18.1 | 68.1,25.9 67.5,25.9 67.25,25.65 U$5.26 67.25,22.65 66.7,22.1 66.3,22.1 v65.8,21.6 | U$5.6 64.05,20.45 64.4,20.8 64.4,21.8 64.25,21.95 U$5.3 61.15,21.95 v61.1,22
  Top 0.406: C65.1 18.25,2 R77.2 19,4.3 v19.2,4.5 | v45.3,15.7 43.93,15.7 U$1.4
  Top 0.813: R5.1 14,68.2 v13.9,68.1 | R6.1 27.1,68.2 v27,68.1 | R21.1 40.3,68.2 v40.2,68.1 | R22.1 53.3,68.2 v53.2,68.1 | R23.1 66.3,68.2 v66.2,68.1 | R24.1 79.6,68.2 v79.5,68.1
  Top 1.016: v11.4,65.2 11.4,67.5 12,68.1 v13.9,68.1
  Top 1.27: R21.1 39.6,68.2 39.2,67.8 v39.2,62 | v44,51.5 45.8,51.5 IC5.4 v47.3,51.41 v47.3,51.4 | C30.1 37.1,34.6 v36.9,34.8
  Bottom 0.254: v65.8,21.6 61.4,21.6 61.1,21.9 v61.1,22
  Bottom 0.406: v19.2,4.5 19.2,8.2 19.6,8.6 25.8,8.6 26.9,9.7 29.3,9.7 30,10.4 30,11.9 30.4,12.3 43.6,12.3 44,12.7 44,14.4 v45.3,15.7
  Bottom 0.813: v13.9,68.1 v27,68.1 v40.2,68.1 v53.2,68.1 v66.2,68.1 68.9,68.1 | 68.9,68.1 v79.5,68.1 | 67.98,68.08 68.9,68.1
  Bottom 1.016: 9.6,63.4 v11.4,65.2
  Bottom 1.27: v39.2,62 39.2,52.5 40.2,51.5 | 40.2,51.5 v44,51.5 | v47.3,51.4 55.3,51.4 56.4,52.5 57.95,52.5 C16.+ | 40.2,51.5 34,51.5 32.4,49.9 32.4,34.7 | 32.4,34.7 32.4,19.8 33.4,18.8 39.2,18.8 41.6,16.4 44.6,16.4 v45.3,15.7 | v36.9,34.8 32.5,34.8 32.4,34.7
5VREG  (via drill 0.5 pad 0.25)
  Top 1.016: 44.43,59.8 C27.+
  Top 1.27: v28.3,60 31.2,60
  Top 1.422: IC2.4 23.2,47.3 23.8,46.7 28,46.7 29.5,48.2 L2.2
  Top 1.778: 44.43,59.8 44.5,59.8 44.3,60 31.2,60 29.5,58.3 L2.2 | C27.+ 49.82,59.87 D3.A
  Bottom 1.27: JP2.27 6.51,69.21 7.7,70.4 11.3,70.4 12,69.7 12,67.2 12.7,66.5 24.7,66.5 24.7,60.9 25.6,60 v28.3,60
24V  (via drill 0.5)
  Top 0.813: v5.7,71.6 5.7,65.83
  Top 1.016: JP2.26 2.8,65.8 2.83,65.83 | C26.+ 9.57,65.83 | 18.09,49.1 IC2.1 17.61,49.6
  Top 1.27: 9.5,65.73 C26.+
  Top 1.422: 2.8,65.8 JP2.25 | JP2.26 2.76,65.77 | 17.61,49.6 15.2,49.6 14.3,50.5 14.2,63.4 10.5,63.4 9.5,64.4 9.5,65.73 | C26.+ 5.7,65.83 2.83,65.83
  Bottom 0.813: 15.59,70.31 ZMX.3 15.5,72.09 15.3,72 5.9,72 5.7,71.7 v5.7,71.6 | 15.59,70.31 16.5,69.4 28.4,69.4 | 28.4,69.4 41.7,69.4 | 41.7,69.4 54.6,69.4 | 54.6,69.4 68.2,69.4 | 68.2,69.4 80.7,69.4 81.2,69.9 XMN.3 | XMX.3 68.09,69.51 68.2,69.4 | YMN.3 54.89,69.69 54.6,69.4 | YMX.3 41.79,69.49 41.7,69.4 | ZMN.3 28.69,69.69 28.4,69.4 | 15.59,70.31 ZMX.3
COOLANT
  Top 0.254: U1.14 17.3,14.4 16.7,13.8 12.9,13.8 12,14.7 12,29.4 11.3,30.1 6.1,30.1 5.1,31.1 5.1,58.7 4.7,59.1 2.85,59.1 JP2.23
D+  (1 unrouted)
D-  (1 unrouted)
DIR1  (via drill 0.5 pad 0.25)
  Top 0.254: U1.9 17.5,18.4 16.4,17.3 16.4,15.9 v16,15.5
  Bottom 0.254: JP2.5 6.93,13.33 9.2,15.6 15.8,15.6 v16,15.5
DIR2  (via drill 0.5 pad 0.25)
  Top 0.254: v20.7,17.5 20.6,17.6 U1.10
  Bottom 0.254: JP2.8 6.45,20.95 10,17.4 20.3,17.4 20.4,17.5 v20.7,17.5
DIR3  (via drill 0.5 pad 0.25)
  Top 0.254: v25.4,16 25,16 24.4,15.4 v24.4,14.3 | v20.7,15.5 19.5,16.8 U1.11
  Bottom 0.254: JP2.11 4.03,28.57 9.6,23 23.3,23 24,22.3 24,21 24.4,20.6 24.4,20.2 26,18.6 26,16.6 v25.4,16 | v24.4,14.3 23.2,14.3 22,15.5 v20.7,15.5
DM0  (2 unrouted)
DM1  (3 unrouted)
DM2  (3 unrouted)
DM3  (3 unrouted)
DM4  (3 unrouted)
DP0  (2 unrouted)
DP1  (3 unrouted)
DP2  (3 unrouted)
DP3  (3 unrouted)
DP4  (3 unrouted)
DTR
  Top 0.305: C1.2 29.3,23.3 29.8,22.8 29.8,19 30.5,18.3 32.9,18.3 33.4,17.8 33.4,17.3 33.5,17.2 35.1,17.2 35.5,16.8 35.5,16 35.8,15.7 38.47,15.7 U$1.13
EN1  (via drill 0.5 pad 0.25)
  Top 0.254: JP2.4 6.61,10.79 7,10.4 15.6,10.4 v15.8,10.6 | v24.8,9.8 U1.23
  Bottom 0.254: v15.8,10.6 16.4,11.2 24.2,11.2 24.8,10.6 v24.8,9.8
EN2  (via drill 0.5 pad 0.25)
  Top 0.254: v25.4,15 25.6,14.8 U1.24
  Bottom 0.254: JP2.7 8.19,18.41 9.8,16.8 23.4,16.8 23.8,16.4 23.8,15.5 24.3,15 v25.4,15
EN3  (via drill 0.5 pad 0.25)
  Top 0.254: v16,21.8 15.2,22.6 v15.2,24.3 | v28.3,12.8 U1.25
  Bottom 0.254: JP2.10 5.77,26.03 9.4,22.4 15.4,22.4 v16,21.8 | v15.2,24.3 15.4,24.3 15.5,24.2 23.9,24.2 25.4,22.7 25.4,22 25.7,21.7 25.7,19.7 26.5,18.9 26.5,14.6 v28.3,12.8
GND  (via drill 0.5 pad 0.25, 3.2 pad 6.45)  (25 unrouted)
  Top 0.254: U1.5 22.4,21 22.6,21.2 23.1,21.2 | 23.8,21.2 24,21 U1.3 24,18.3 24.6,17.7 24.6,17.2 24.2,16.7 22.6,16.7 22.2,16.3 22.2,15.6 23.2,14.6 U1.21 23.2,8.5 C31.1 | C23.1 23.8,22.1 23.8,21.2 | C24.1 17,22 v17.2,21.8 | v23.1,21.8 23.1,21.2 | 23.1,21.2 23.8,21.2 | U$5.27 66.75,22.85 66.6,22.7 66.2,22.7 | 66.2,22.7 65.2,22.7 | 65.2,22.7 65,22.7 64.75,22.95 U$5.31 | U$5.28 66.25,22.75 66.2,22.7 | U$5.7 64.55,19.95 | 64.55,19.95 65,20.4 65,22.5 65.2,22.7 | U$5.8 64.05,19.45 64.55,19.95
  Top 0.305: C23.1 25.2,23.9 26.2,24.9 31.6,24.9 | 34.4,24.1 34.4,23.6 C28.1 v35.3,23.5 | v41.3,23.5 C29.1 | U$1.1 43.2,11.86 41.15,11.86 40.6,12.4 v40.6,19.3
  Top 0.406: C25.1 42.9,11.55 43.2,11.86 | C30.2 31.8,32.8 31.2,32.2 31.2,25.3 31.6,24.9 33.6,24.9 34.4,24.1 | C65.2 15.35,2 LED9.C 10.45,4.05 v9.5,4
  Top 0.61: JP12.1 JP11.1 JP10.1
  Top 0.813: C64.C 86.7,65.4 | C17.1 86.7,65.4 | 86.7,65.4 86.7,70.3 XMN.2 85,74.4 | C18.1 73.7,70.2 XMX.2 71.9,75.2 | C19.1 60.4,70.3 YMN.2 58.7,75.2 | C20.1 47.4,70.2 YMX.2 45.5,72 45.5,75.2 | C21.1 34.3,70.2 ZMN.2 32.5,75.2 | C22.1 21.2,70.2 ZMX.2 19.4,75.2 | 19.4,75.2 32.5,75.2 | 32.5,75.2 45.5,75.2 | 45.5,75.2 58.7,75.2 | 58.7,75.2 71.9,75.2 | 71.9,75.2 84.2,75.2 85,74.4 | 19.4,75.2 9.7,75.2 v9.5,76 | v96,76 85.6,75 85,74.4 | C26.- 9.4,74.9 v9.5,76 | JP2.30 JP2.29 | JP2.29 JP2.28 | JP2.29 8.79,74.29 v9.5,76
  Top 1.016: IC2.3 IC2.6 | IC2.5 24.9,54.04 IC2.6 | IC2.6 21.5,61.7 | v22.5,65 C22.1 | D2.2 15.82,47.12 v16.6,47.9 | v16.6,51.5 16.6,54.9 21.04,61.57 | 21.04,61.57 v21.3,62 21.5,61.8 21.5,61.7 | v17,62 17,61.9 v18.1,60.8 18.1,61 v19.1,62 19.1,61.9 v20.2,60.8 20.27,60.8 21.04,61.57 | 21.5,61.7 v22.4,60.8 22.4,61 v23.4,62 v24.6,60.8 24.6,61 v25.6,62 | JP6.3 JP6.2 JP6.1 JP7.3 JP7.2 | JP7.1 15.82,46.3
  Top 1.27: v62,65.1 60.5,65.1 C19.1 | JP7.1 JP7.2 | 15.82,46.3 D2.2 | C20.1 v47.4,62 | C27.- v47.4,57.33 48.77,57.33 50.3,55.8 50.3,50.3 51.4,49.2 53,49.2 IC5.1 57.17,49.12 C16.- | C31.1 28.8,7.9 29.7,7 30.91,7 C15.- | v96,4 89.48,5 S1.4 S1.3
  Bottom 0.254: v23.1,21.8 22.6,21.8 22.2,22.2 21,22.2 20.6,21.8 v17.2,21.8 16.5,21.1 JP11.1
  Bottom 0.305: v35.3,23.5 40.7,23.5 | 40.7,23.5 v41.3,23.5 | v40.6,19.3 40.6,23.4 40.7,23.5
  Bottom 0.61: JP7.1 10.2,44.8 JP14.1 JP9.1 JP12.1 | JP10.1 10.2,5.7 v9.5,4 5.9,1.4 JP13.1
  Bottom 1.016: v21.3,62 21.3,63.8 v22.5,65 | v16.6,47.9 v16.6,51.5
  Bottom 1.27: v47.4,62 v47.4,57.33 | v96,76 96.9,75 98.9,73 98.9,40.8 98,39.9 89.8,39.9 88.82,38.92 X14.GND 88.82,39.02 89.7,39.9 97.7,39.9 98.9,38.7 98.9,7.6 98.1,6.8 96.8,6.8 v96,4
GRBL_RX  (via drill 0.5 pad 0.25)
  Top 0.305: U1.30 31.6,16.8 v32,16.4 | v41.6,13.1 43.87,13.1 U$1.2
  Bottom 0.305: v32,16.4 38.3,16.4 v41.6,13.1
GRBL_TX  (via drill 0.5 pad 0.25)
  Top 0.305: U1.31 32.1,17.6 v32.2,17.5 | v41.6,14.4 U$1.3
  Bottom 0.305: v32.2,17.5 32.7,17 39,17 v41.6,14.4
MISO
  Top 0.254: JP2.2 3.71,5.71 7.2,9.2 18.2,9.2 18.8,9.8 18.8,12.51 U1.16
MOSI
  Top 0.254: JP2.3 5.45,8.25 7,9.8 16.4,9.8 17.2,10.6 17.2,13.2 17.6,13.6 U1.15
N$1  (via drill 0.8 pad 0.61)
  other vias: 40,-35.9
N$2  (via drill 0.8 pad 0.61)
  other vias: 41.8,-35.9
N$3  (1 unrouted)
  Top 0.254: U$5.22 67.35,21.95 65.9,20.5 | 65.9,20.5 64.75,19.35 U$5.10 | U$5.18 67.15,19.95 66.75,19.55 U$5.14 66.75,19.65 65.9,20.5
N$4
  Top 0.305: 12MHZ.1 35,28.1 37.1,26 C28.2 37.4,23.2 38.6,23.2 42.33,19.48 U$1.7
N$5  (via drill 0.8 pad 0.61)
  other vias: 54.1,-35.6
N$6
  Top 0.813: D7.1 88.75,71.94 XMN.1
N$7  (via drill 0.8 pad 0.61)
  other vias: 54.1,-33.1
N$8
  Top 0.813: D8.1 75.75,71.36 75.7,71.4 XMX.1
N$9
  Top 1.016: 19.8,46.02 D2.1
  Top 1.422: IC2.2 19.8,46.02 | L2.1 36.1,54.3 33.6,51.8 33.6,47.3 30.9,44.6 21.18,44.6 D2.1
N$10
  Top 0.813: D9.1 62.45,71.94 YMN.1
N$12
  Top 0.813: D10.1 49.45,71.97 YMX.1
N$13
  Top 0.254: U1.7 20.8,21.9 C23.2 22.4,23.77 Q1.2
N$14
  Top 0.254: U1.8 20,23.4 C24.2 19.8,25.37 Q1.1
N$15
  Top 0.813: D11.1 36.31,67.83 ZMN.1
N$16
  Top 0.813: D12.1 23.25,71.97 ZMX.1
N$19
  Top 0.305: 12MHZ.2 44.63,24.07 C29.2 45.2,22.05 U$1.8
N$80
  Top 0.61: R77.1 LED9.A
RESET  (2 unrouted)
RESET_GRBL  (via drill 0.5 pad 0.25)
  Top 0.254: v28.7,16 28.9,16.2 30.3,16.2 31,15.5 v32.3,15.5
  Top 0.305: v28.7,16 U1.29 | C1.1 28.2,19.9 28.8,19.3 v28.8,18.7 | R11.1 32.8,15.8 32.5,15.5 v32.3,15.5 | v82.9,1 83.5,1 83.7,1.2 83.69,1.9 | 83.69,1.9 S1.1 | 83.69,1.9 83.69,6.93 S1.2
  Bottom 0.305: v28.8,18.7 28.8,16.1 v28.7,16 | v32.3,15.5 32.2,15.5 32,15.3 32,13.1 31.8,12.9 29.9,12.9 29.3,12.3 29.3,10.6 29,10.3 26.6,10.3 25.5,9.2 14.4,9.2 13.2,8 13.2,1.6 14.2,0.6 82.5,0.6 v82.9,1
SCK
  Top 0.254: JP2.1 4.57,3.17 5.6,4.2 5.6,6.8 7.4,8.6 18.8,8.6 20,9.8 U1.17
SPIN-PWM  (via drill 0.5 pad 0.25)
  Top 0.254: U1.13 17.4,15.2 16.5,14.3 13.1,14.3 12.5,14.9 12.5,29.7 11.6,30.6 6.5,30.6 5.7,31.4 5.7,52.2 v6.3,52.8
  Bottom 0.254: v6.3,52.8 6.3,53.7 6,54 2.83,54 JP2.21
SPINDLE-DIR/EN  (via drill 0.5 pad 0.25)
  Top 0.254: U1.12 17.5,16 16.3,14.8 13.3,14.8 13,15.1 13,30 11.9,31.1 7,31.1 6.3,31.8 6.3,50.7 v7,51.4
  Bottom 0.254: v7,51.4 2.83,51.4 JP2.20
STP1  (via drill 0.5 pad 0.25)
  Top 0.254: v23,16 24.2,16 25.8,17.6 25.8,18.2 26,18.4 U1.32
  Bottom 0.254: JP2.6 8.67,15.87 9,16.2 22.8,16.2 v23,16
STP2  (via drill 0.5 pad 0.25)
  Top 0.254: v25.1,18.3 25.6,18.8 U1.1
  Bottom 0.254: JP2.9 4.71,23.49 10.2,18 19.5,18 19.8,18.3 v25.1,18.3
STP3  (via drill 0.5 pad 0.25)
  Top 0.254: v24.8,21.4 U1.2
  Bottom 0.254: JP2.12 4.29,31.11 4.8,30.6 4.8,28.6 9.8,23.6 23.6,23.6 24.8,22.4 v24.8,21.4
VCC  (via drill 0.5 pad 0.25)
  Top 0.254: U1.6 21.6,18.6 22,18.2 | U1.4 23.2,18.6 22.8,18.2 22,18.2 | 22,18.2 22,17.1 21.5,16.6 v21.5,13.6 21.5,13.1 20.8,12.4 U1.18 20.8,8.1 C31.2 | R11.2 29.8,13 v28.4,11.6
  Top 0.305: U$1.16 34.84,11.86 R11.2 | U1.6 v21.6,21.3
  Top 0.406: U$1.16 39.74,11.86 40.2,11.4 40.2,9.8 C25.2 | C64.A 95.1,64.5 94.2,63.6 84.6,63.6 83.7,62.7 56.9,62.7 56.2,62 56.2,60.2 55.9,59.9
  Top 0.813: v13.9,24.7 v13.9,20.1
  Top 1.016: JP4.1 JP4.2 JP4.3
  Top 1.27: D3.C 55.9,59.9 56.2,59.9 | 56.2,59.9 D1.C | IC5.3 55.48,53.69 56,54.2 56,54.7 | 56,54.7 56,59.7 56.2,59.9 | C15.+ 32.17,9.47 33.6,10.9 33.6,12.9 R11.2 | v8.3,39.5 11.6,39.5 14.4,42.3 31.8,42.3 36.6,47.1 58.9,47.1 60.1,48.3 60.1,53.5 59.1,54.5 56.2,54.5 56,54.7
  Bottom 0.254: v28.4,11.6 25.5,11.6 23.5,13.6 v21.5,13.6
  Bottom 0.813: JP4.1 9.6,46.6 8.4,45.4 8.4,26.3 10.3,24.4 13.6,24.4 v13.9,24.7 | v13.9,20.1 17,20.1 17.7,20.8 21.1,20.8 v21.6,21.3
  Bottom 1.27: JP4.1 9.6,46.5 8.3,45.2 v8.3,39.5
VUSB  (1 unrouted)
  Top 1.27: D1.A 63.7,59.9 65.3,61.5 97.3,61.5 98.7,60.1 98.7,40.8 97.9,40 87.3,40 86.8,39.5 86.8,37.95 X14.VBUS
XEND  (via drill 0.5 pad 0.25)  (1 unrouted)
  Top 0.254: U1.26 28.9,13.6 29,13.5 31.1,13.5 v31.3,13.7 | v56.5,63.4 70.4,63.4 70.8,63.8 70.8,64.9 C18.2 | 70.86,65.05 70.86,63.74 71.2,63.4 83.3,63.4 83.8,63.9 83.8,65 C17.2 83.6,65.4 R24.2
  Top 0.813: R23.2 70.5,65.4 70.86,65.05 | 70.86,65.05 C18.2 | 83.9,65.4 83.9,67.75 D7.2 | D8.2 70.86,65.05
  Bottom 0.254: v31.3,13.7 31.3,16.8 31.1,17 31.2,57.8 31.2,61.4 31.9,62.1 32.3,62.1 33.1,62.9 40.9,62.9 41.1,62.7 42.1,62.7 42.3,62.9 56,62.9 v56.5,63.4
XTAL1  (1 unrouted)
  Top 0.254: U$5.30 65.25,28.95 64.6,29.6 Q2.2
XTAL2  (1 unrouted)
  Top 0.254: U$5.29 65.75,28.85 66.5,29.6 Q2.1
YEND  (via drill 0.5 pad 0.25)  (2 unrouted)
  Top 0.254: U1.27 30.3,14.4 v30.5,14.6 | v54.7,63.8 R22.2 | R21.2 41.7,63.7 v41.5,63.5
  Top 0.813: R22.2 57.4,65.5 C19.2 | R21.2 44.2,65.4 C20.2 | D9.2 57.76,65.14 | D10.2 44.55,65.05
  Bottom 0.254: v30.5,14.6 30.6,57.8 30.6,61.7 31.6,62.7 32,62.7 32.8,63.5 41,63.5 v41.5,63.5 54.4,63.5 v54.7,63.8
ZEND  (via drill 0.5 pad 0.25)  (2 unrouted)
  Top 0.254: U1.28 29.4,15.2 v29.7,15.5 | v31.5,63.5 C21.2 31.1,65.4 R6.2 28.5,65.3 28.5,64.2 27.8,63.5 19.1,63.5 18.4,64.2 C22.2 18,65.4 R5.2
  Top 0.813: D11.2 31.45,65.7 | 31.45,65.7 31.45,65.05 | 31.16,65.4 31.45,65.7 | D12.2 18.36,65.5 | 18.36,65.5 18.36,65.05 | 18.25,65.4 18.36,65.5
  Bottom 0.254: v29.7,15.5 29.7,16.8 29.9,17 30,57.8 30,62 v31.5,63.5

### Text on the board
tPlace: Z-MAX | Z-MIN | Y-MAX | Y-MIN | X-MAX | X-MIN | GND | 5V | 220U | 24V | 100U | SERIAL | COOL | 220U | MISO1 | 5V | GND | 33uH | LM2596 | TPWM | GND | TDIR.EN | GND | GND | STEP3 | DIR3 | GND | EN/CS3 | STEP2 | DIR2 | GND | EN/CS2 | STEP1 | DIR1 | GND | EN/CS1 | MOSI | MISO | SCK | GND